# Altium schematic sheet WL-RF-CONTROL.SchDoc
size 420 x 297 mm; Address1: Address1; Address2: Address2; Address3: Address3; Address4: Address4; DocumentNumber: WOLF-RF-UNIT; SheetNumber: 3; Scale: 1:1; DocumentType: Схема электрическая принципиальная; FirstReferrence: АБВГ.123456.001
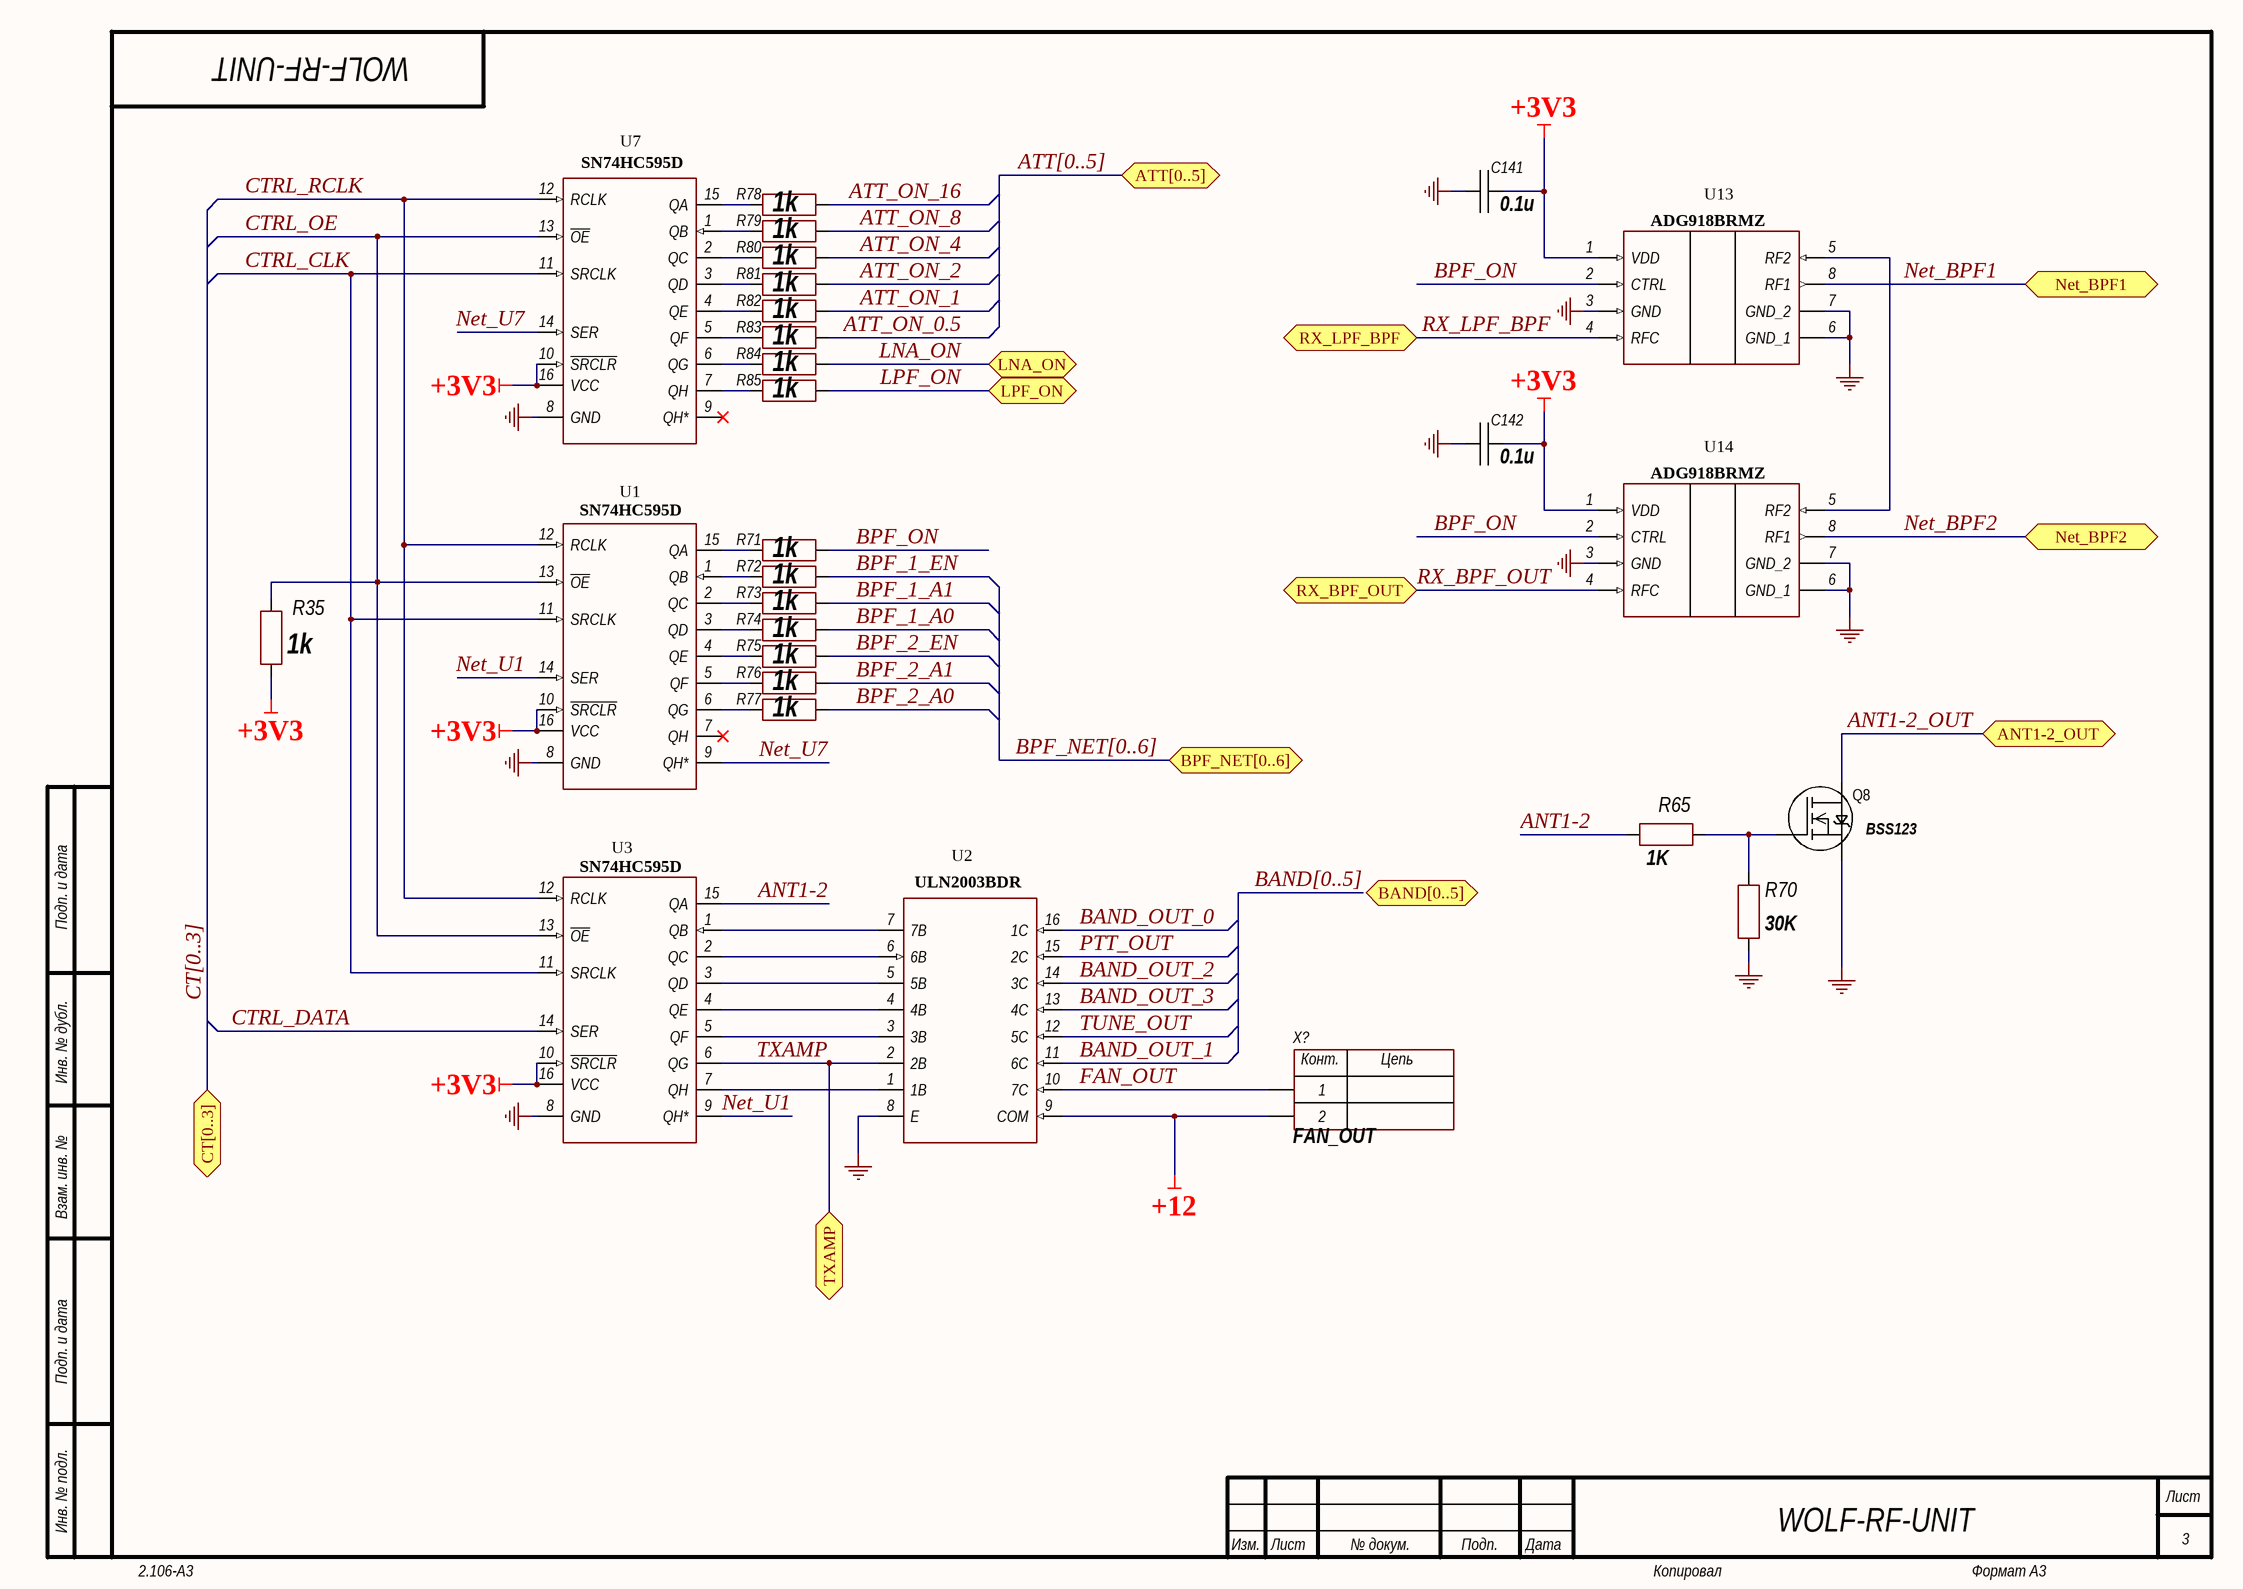
[diagram p0: WL-RF-CONTROL.SchDoc]

## Parts
C141  0.1u  [CH0201C]
C142  0.1u  [CH0201C]
Q8  BSS123  [SOT23_132]
R35  1k  [CH0805R]
R65  1K  [CH0805R]
R70  30K  [CH0805R]
R71  1k  [CH0805R]
R72  1k  [CH0805R]
R73  1k  [CH0805R]
R74  1k  [CH0805R]
R75  1k  [CH0805R]
R76  1k  [CH0805R]
R77  1k  [CH0805R]
R78  1k  [CH0805R]
R79  1k  [CH0805R]
R80  1k  [CH0805R]
R81  1k  [CH0805R]
R82  1k  [CH0805R]
R83  1k  [CH0805R]
R84  1k  [CH0805R]
R85  1k  [CH0805R]
U1  SN74HC595D  [16-SOIC]
U2  ULN2003BDR  [16-SOIC]
U3  SN74HC595D  [16-SOIC]
U7  SN74HC595D  [16-SOIC]
U13  ADG918BRMZ  [8-MSOP (NO PAD)]
U14  ADG918BRMZ  [8-MSOP (NO PAD)]
X?  FAN_OUT  [CON: 300-02P-5.0]

## Ports
ANT1-2_OUT (bidir), ATT[0..5] (bidir), BAND[0..5] (bidir), BPF_NET[0..6] (bidir), CT[0..3] (bidir), LNA_ON (bidir), LPF_ON (bidir), Net_BPF1 (bidir), Net_BPF2 (bidir), RX_BPF_OUT (bidir), RX_LPF_BPF (bidir), TXAMP (bidir)

## Nets
+3V3: C141.1 C142.1 R35.2 U1.10(~{SRCLR}) U1.16(VCC) U3.10(~{SRCLR}) U3.16(VCC) U7.10(~{SRCLR}) U7.16(VCC) U13.1(VDD) U14.1(VDD)
+12: U2.9(COM) X?.2
GND: C141.2 C142.2 Q8.2(I) R70.1 U1.8(GND) U2.8(E) U3.8(GND) U7.8(GND) U13.3(GND) U13.6(GND_1) U13.7(GND_2) U14.3(GND) U14.6(GND_1) U14.7(GND_2)
ANT1-2: R65.2 U3.15(QA)
ANT1-2_OUT: Q8.3(Сток(Drain)) ; port ANT1-2_OUT
ATT_ON_0.5: R83.1
ATT_ON_1: R82.1
ATT_ON_2: R81.1
ATT_ON_4: R80.1
ATT_ON_8: R79.1
ATT_ON_16: R78.1
BAND_OUT_0: U2.16(1C)
BAND_OUT_1: U2.11(6C)
BAND_OUT_2: U2.14(3C)
BAND_OUT_3: U2.13(4C)
BPF_1_A0: R74.1
BPF_1_A1: R73.1
BPF_1_EN: R72.1
BPF_2_A0: R77.1
BPF_2_A1: R76.1
BPF_2_EN: R75.1
BPF_ON: R71.1 U13.2(CTRL) U14.2(CTRL)
CTRL_CLK: U1.11(SRCLK) U3.11(SRCLK) U7.11(SRCLK)
CTRL_DATA: U3.14(SER)
CTRL_OE: R35.1 U1.13(~{OE}) U3.13(~{OE}) U7.13(~{OE})
CTRL_RCLK: U1.12(RCLK) U3.12(RCLK) U7.12(RCLK)
FAN_OUT: U2.10(7C) X?.1
LNA_ON: R84.1 ; port LNA_ON
LPF_ON: R85.1 ; port LPF_ON
Net_BPF1: U13.8(RF1) ; port Net_BPF1
Net_BPF2: U14.8(RF1) ; port Net_BPF2
Net_U1: U1.14(SER) U3.9(QH*)
Net_U7: U1.9(QH*) U7.14(SER)
PTT_OUT: U2.15(2C)
RX_BPF_OUT: U14.4(RFC) ; port RX_BPF_OUT
RX_LPF_BPF: U13.4(RFC) ; port RX_LPF_BPF
TUNE_OUT: U2.12(5C)
TXAMP: U2.2(2B) U3.6(QG) ; port TXAMP
NetQ8_1: Q8.1(Затвор(Gate)) R65.1 R70.2
NetR71_2: R71.2 U1.15(QA)
NetR72_2: R72.2 U1.1(QB)
NetR73_2: R73.2 U1.2(QC)
NetR74_2: R74.2 U1.3(QD)
NetR75_2: R75.2 U1.4(QE)
NetR76_2: R76.2 U1.5(QF)
NetR77_2: R77.2 U1.6(QG)
NetR78_2: R78.2 U7.15(QA)
NetR79_2: R79.2 U7.1(QB)
NetR80_2: R80.2 U7.2(QC)
NetR81_2: R81.2 U7.3(QD)
NetR82_2: R82.2 U7.4(QE)
NetR83_2: R83.2 U7.5(QF)
NetR84_2: R84.2 U7.6(QG)
NetR85_2: R85.2 U7.7(QH)
NetU2_1: U2.1(1B) U3.7(QH)
NetU2_3: U2.3(3B) U3.5(QF)
NetU2_4: U2.4(4B) U3.4(QE)
NetU2_5: U2.5(5B) U3.3(QD)
NetU2_6: U2.6(6B) U3.2(QC)
NetU2_7: U2.7(7B) U3.1(QB)
NetU13_5: U13.5(RF2) U14.5(RF2)

Not connected (* = marked no-connect by the designer): U1 7(QH)*; U7 9(QH*)*

## Buses and harness runs
bus ATT[0..5] = port ATT[0..5]
bus BAND[0..5]
bus BPF_NET[0..6] = port BPF_NET[0..6]
bus CT[0..3] = port CT[0..3]

## Notes on the sheet
- Подп. и дата
- Инв. № дубл.
- Взам. инв. №
- Инв. № подл.
- Изм.
- Лист
- № докум.
- Подп.
- Дата
- 2.106-A3
- Копировал
- Формат А3
- (in symbol 2-Connector) Конт.; Цепь

## Library data of the parts
C141 C142 = Capacitor: Manufacturer: *; Model: *; HelpURL: *; ComponentKind: *; Value: *
Q8 = N-KANAL
R35 R65 R70-R85 = Resistor: Manufacturer: *; Model: *; HelpURL: *; ComponentKind: *; Value: *
U2 = ULN2003BDR_1
X? = 2-Connector: Model: *; Manufacturer: *; HelpURL: *; ComponentKind: *